# Altium schematic sheet Sheet1.SchDoc
size A4
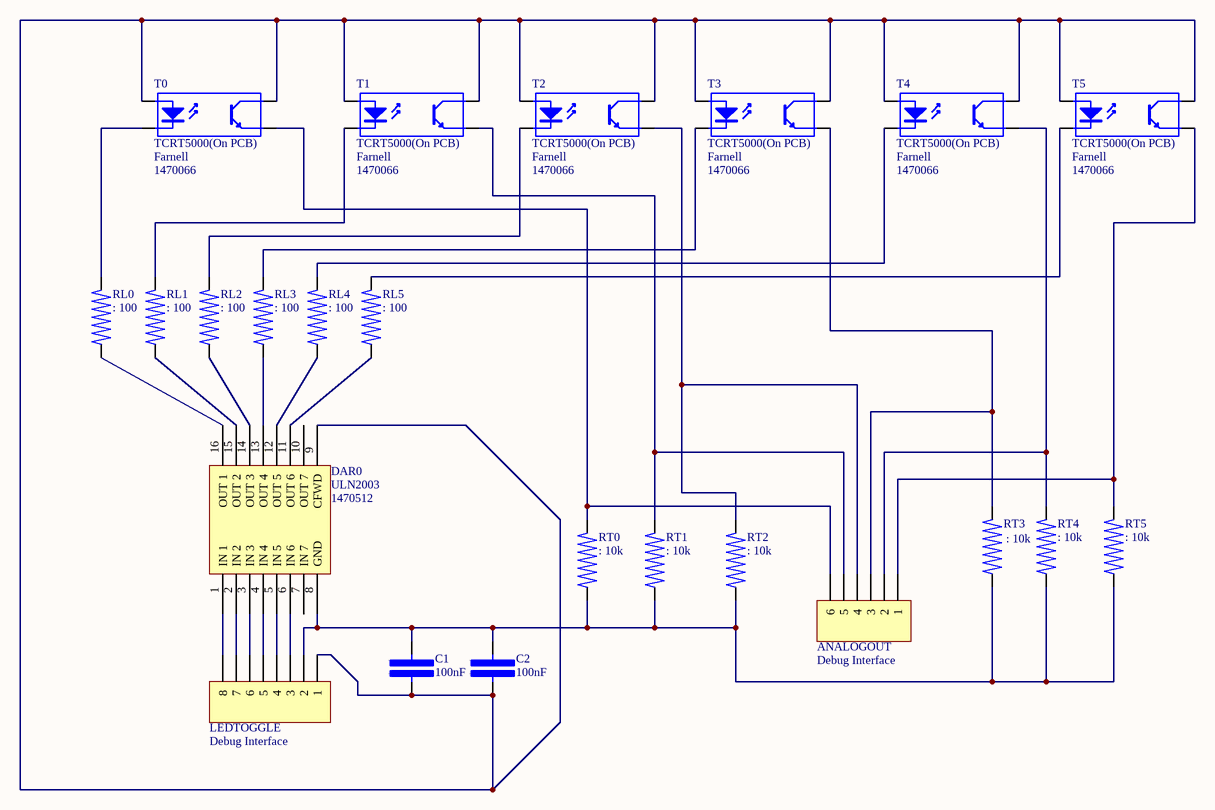
[diagram p0: Sheet1.SchDoc]

## Parts
ANALOGOUT  Debug Interface  [PROGRAMMING-HEADER-MICRO]
C1  100nF  [CAPACITOR_100NF_TH]
C2  100nF  [CAPACITOR_100NF_TH]
DAR0  ULN2003  Supplier Part Number 1: 1470512  [DILP-16(300) - 3D]
LEDTOGGLE  Debug Interface  [HDR1X8]
RL0  Resistor (IO board)  [RESISTOR_10K_TH_QW]  (value not drawn)
RL1  Resistor (IO board)  [RESISTOR_10K_TH_QW]  (value not drawn)
RL2  Resistor (IO board)  [RESISTOR_10K_TH_QW]  (value not drawn)
RL3  Resistor (IO board)  [RESISTOR_10K_TH_QW]  (value not drawn)
RL4  Resistor (IO board)  [RESISTOR_10K_TH_QW]  (value not drawn)
RL5  Resistor (IO board)  [RESISTOR_10K_TH_QW]  (value not drawn)
RT0  Resistor (IO board)  [RESISTOR_10K_TH_QW]  (value not drawn)
RT1  Resistor (IO board)  [RESISTOR_10K_TH_QW]  (value not drawn)
RT2  Resistor (IO board)  [RESISTOR_10K_TH_QW]  (value not drawn)
RT3  Resistor (IO board)  [RESISTOR_10K_TH_QW]  (value not drawn)
RT4  Resistor (IO board)  [RESISTOR_10K_TH_QW]  (value not drawn)
RT5  Resistor (IO board)  [RESISTOR_10K_TH_QW]  (value not drawn)
T0  TCRT5000(On PCB)  Supplier 1: Farnell  Supplier Part Number 1: 1470066  [TCRT5000 Breakout]
T1  TCRT5000(On PCB)  Supplier 1: Farnell  Supplier Part Number 1: 1470066  [TCRT5000 Breakout]
T2  TCRT5000(On PCB)  Supplier 1: Farnell  Supplier Part Number 1: 1470066  [TCRT5000 Breakout]
T3  TCRT5000(On PCB)  Supplier 1: Farnell  Supplier Part Number 1: 1470066  [TCRT5000 Breakout]
T4  TCRT5000(On PCB)  Supplier 1: Farnell  Supplier Part Number 1: 1470066  [TCRT5000 Breakout]
T5  TCRT5000(On PCB)  Supplier 1: Farnell  Supplier Part Number 1: 1470066  [TCRT5000 Breakout]

## Nets
NetANALOGOUT_1: ANALOGOUT.1 RT5.2 T5.3(E)
NetANALOGOUT_2: ANALOGOUT.2 RT4.2 T4.3(E)
NetANALOGOUT_3: ANALOGOUT.3 RT3.2 T3.3(E)
NetANALOGOUT_4: ANALOGOUT.4 RT2.2 T2.3(E)
NetANALOGOUT_5: ANALOGOUT.5 RT1.2 T1.3(E)
NetANALOGOUT_6: ANALOGOUT.6 RT0.2 T0.3(E)
NetC1_1: C1.1 C2.1 DAR0.9(CFWD) LEDTOGGLE.1 T0.1(A) T0.4(C) T1.1(A) T1.4(C) T2.1(A) T2.4(C) T3.1(A) T3.4(C) T4.1(A) T4.4(C) T5.1(A) T5.4(C)
NetC1_2: C1.2 C2.2 DAR0.8(GND) LEDTOGGLE.2 RT0.1 RT1.1 RT2.1 RT3.1 RT4.1 RT5.1
NetDAR0_1: DAR0.1(IN_1) LEDTOGGLE.8
NetDAR0_2: DAR0.2(IN_2) LEDTOGGLE.7
NetDAR0_3: DAR0.3(IN_3) LEDTOGGLE.6
NetDAR0_4: DAR0.4(IN_4) LEDTOGGLE.5
NetDAR0_5: DAR0.5(IN_5) LEDTOGGLE.4
NetDAR0_6: DAR0.6(IN_6) LEDTOGGLE.3
NetDAR0_11: DAR0.11(OUT_6) RL5.1
NetDAR0_12: DAR0.12(OUT_5) RL4.1
NetDAR0_13: DAR0.13(OUT_4) RL3.1
NetDAR0_14: DAR0.14(OUT_3) RL2.1
NetDAR0_15: DAR0.15(OUT_2) RL1.1
NetDAR0_16: DAR0.16(OUT_1) RL0.1
NetRL0_2: RL0.2 T0.2(K)
NetRL1_2: RL1.2 T1.2(K)
NetRL2_2: RL2.2 T2.2(K)
NetRL3_2: RL3.2 T3.2(K)
NetRL4_2: RL4.2 T4.2(K)
NetRL5_2: RL5.2 T5.2(K)

Not connected (* = marked no-connect by the designer): DAR0 7(IN_7) 10(OUT_7)

## Notes on the sheet
- (in symbol Resistor(IO board)) 100; 10k

## Library data of the parts
ANALOGOUT = Header 6: Header, 6-Pin; LatestRevisionDate: 17-Jul-2002; LatestRevisionNote: Re-released for DXP Platform.; Publisher: Altium Limited
C1 C2 = Capacitor(IO Board): Capacitor 100nF; Supplier: *; Part Number: *
DAR0 = ULN2003: Darlington Transistor Array; Supplier 1: Farnell
LEDTOGGLE = Header 8: Header, 8-Pin; LatestRevisionDate: 17-Jul-2002; LatestRevisionNote: Re-released for DXP Platform.; Publisher: Altium Limited
RL0-RL5 RT0-RT5 = Resistor(IO board): Resistor (SFR25); Supplier: *; Part Number: *
T0-T5 = TCRT5000(On PCB): 4-Pin Phototransistor Optocoupler; pin to pad: 1>2 2>7 3>6 4>3; Published: 24-Mar-1999; LatestRevisionDate: 04-Mar-2005; LatestRevisionNote: Sch pins 3 & 4 Swapped.; DatasheetVersion: Nov-2003; PackageReference: DIP-4; Publisher: Altium Limited